# EasyEDA Pro project SRH_V1.1.eprj

# Schematic Schematic1
Create Date: 2023-09-27; Page Name: P1; Project Name: SRH_V1.1; Schematic Name: Schematic1; Update Date: 2023-09-27; Company: 嘉立创EDA; Page Size: A4; Version: V1.0
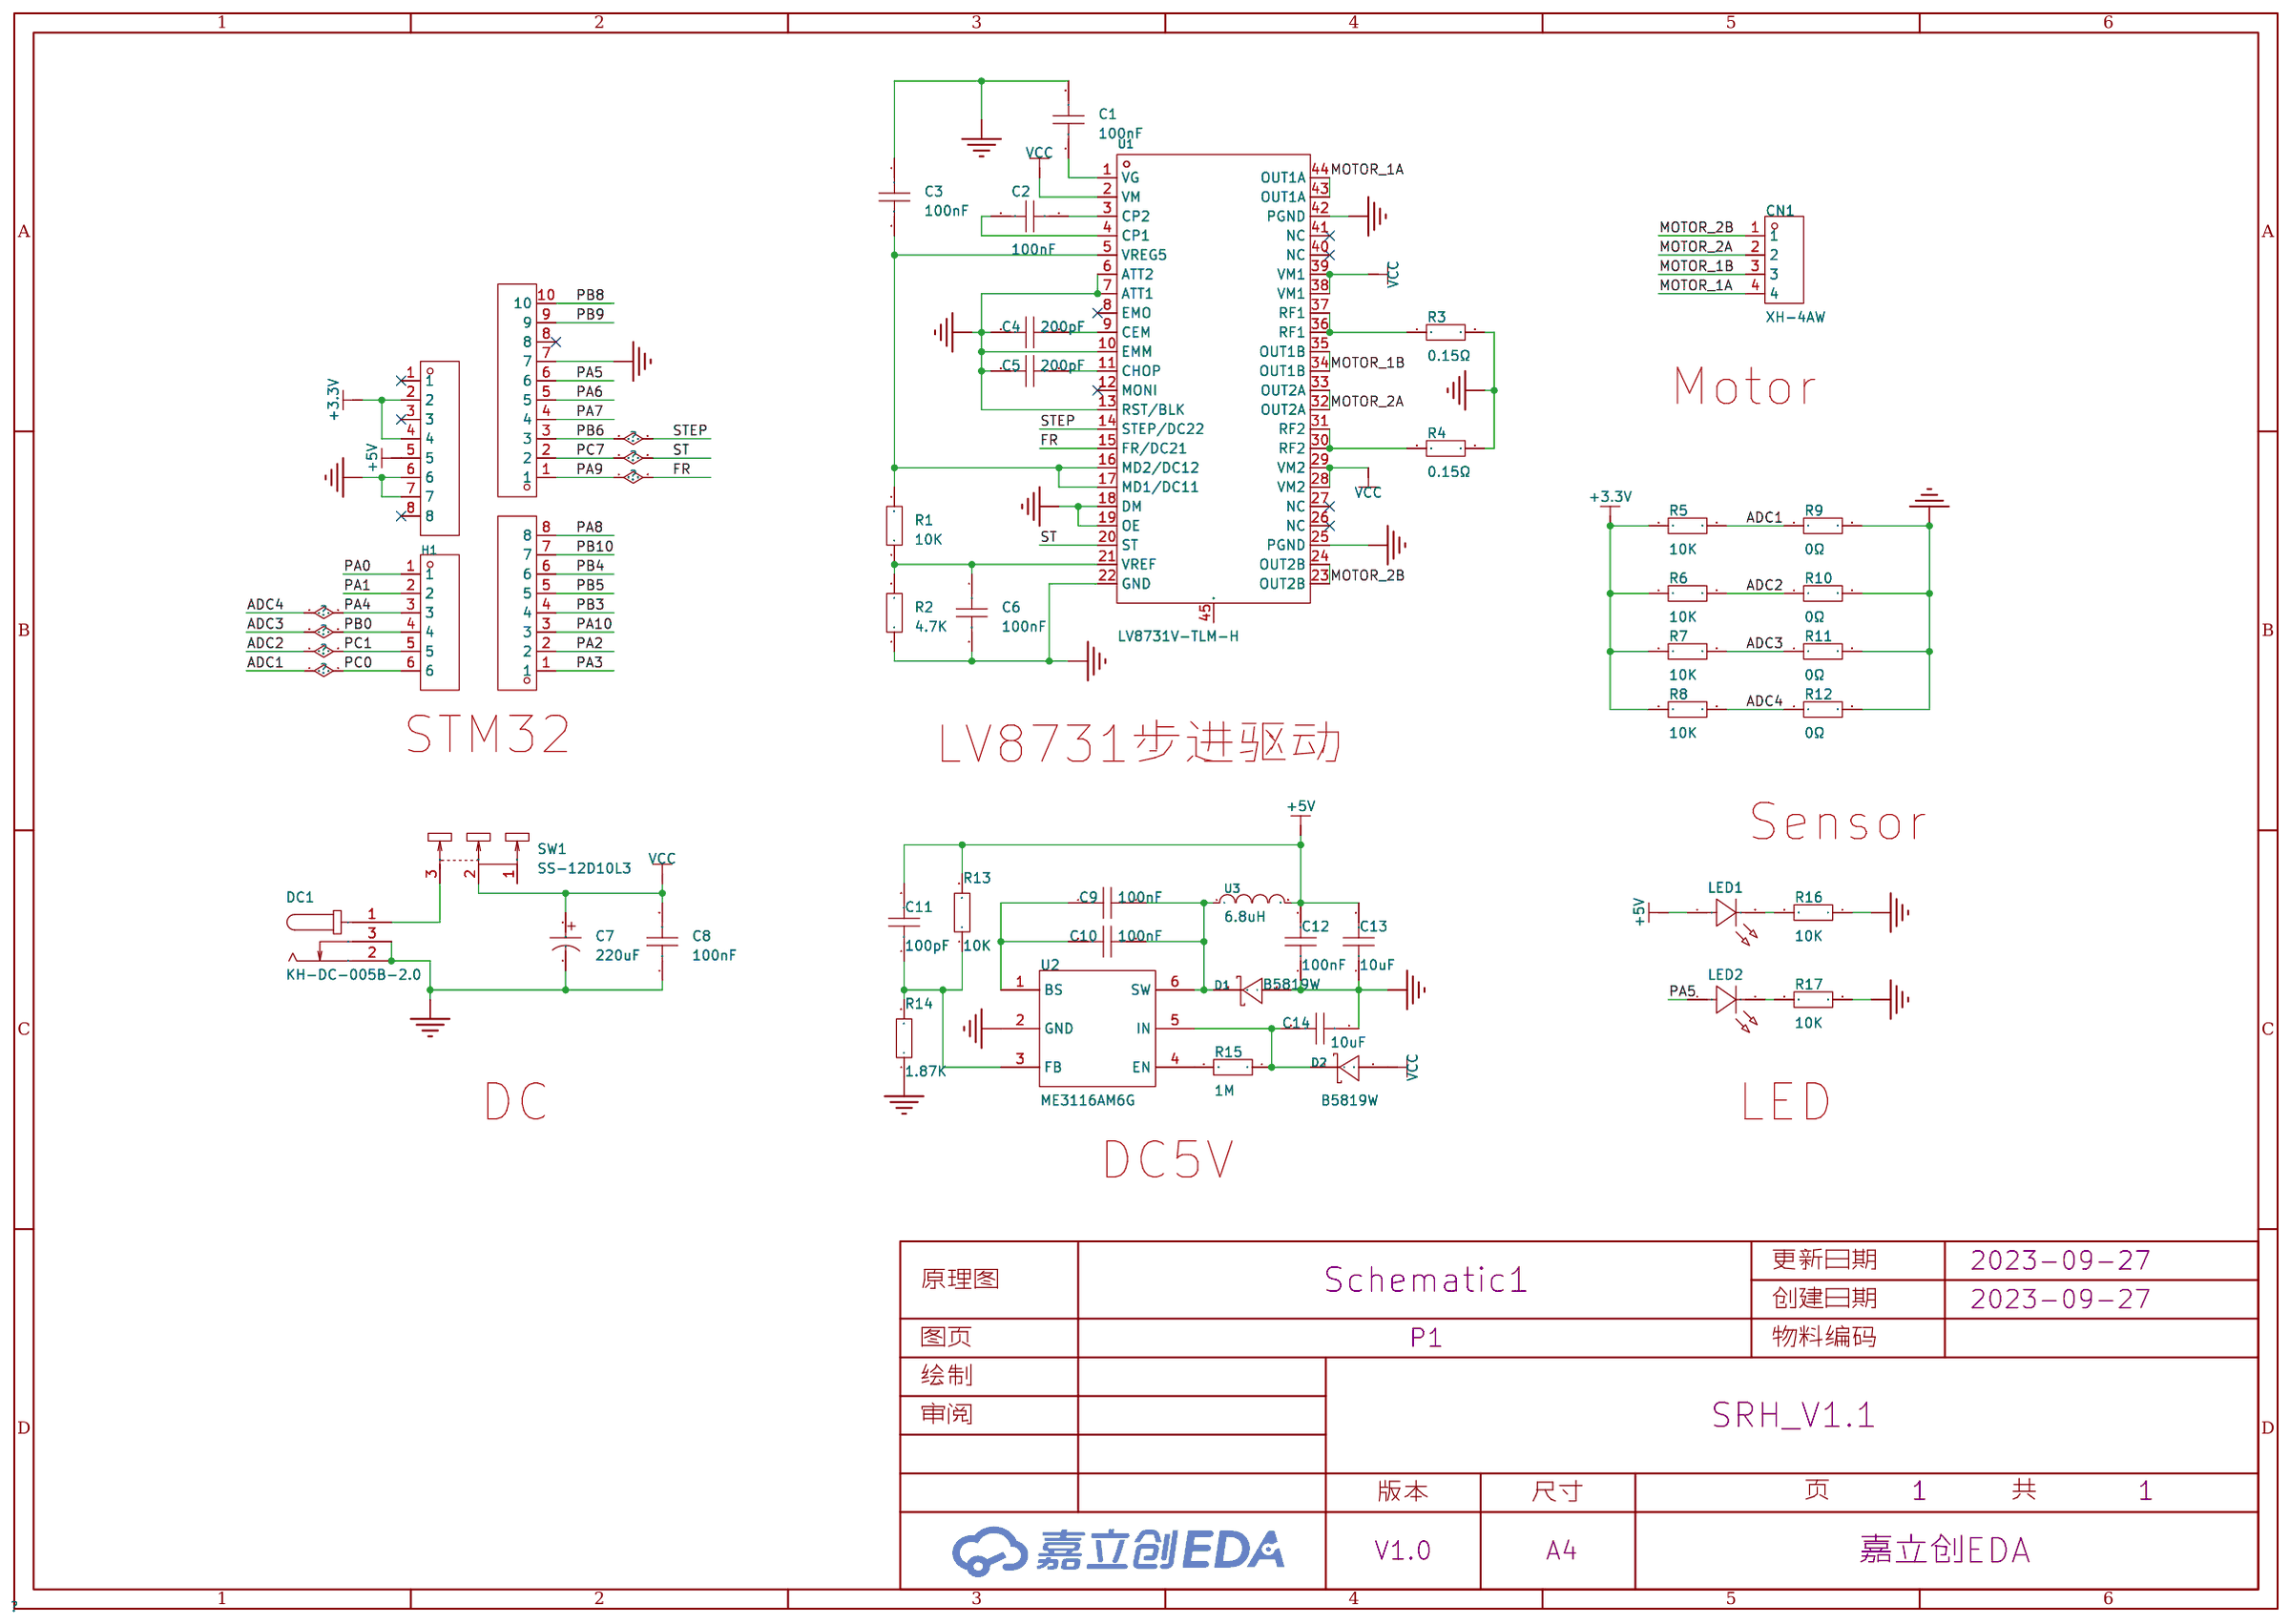
[diagram p0: schematic sheet]

## Parts
C1  100nF  [C0603]
C2  100nF  [C0603]
C3  100nF  [C0603]
C4  200pF  [C0603]
C5  200pF  [C0603]
C6  100nF  [C0603]
C7  220uF  [CAP-TH_BD8.0-P3.50-D0.6-FD]
C8  100nF  [C0603]
C9  100nF  [C0603]
C10  100nF  [C0603]
C11  100pF  [C0603]
C12  100nF  [C0603]
C13  10uF  [C0603]
C14  10uF  [C0603]
CN1  XH-4AW  [CONN-TH_XH-4AW]
D1  B5819W  [SOD-123_L2.8-W1.8-LS3.7-RD]
D2  B5819W  [SOD-123_L2.8-W1.8-LS3.7-RD]
DC1  KH-DC-005B-2.0  [DC-IN-TH_KH-DC-005B-2.0]
H1  PZ254V-11-06P  [HDR-TH_6P-P2.54-V-M]
H2  PZ254V-11-08P  [HDR-TH_8P-P2.54-V-M]
H3  PZ254V-11-08P  [HDR-TH_8P-P2.54-V-M]
H4  PZ254-1-10-Z-8.5  [HDR-TH_10P-P2.54-V-M]
LED1  19-213/GHC-ZN2Q1B8X/3T  [LED-SMD_L1.6-W0.8-RD-2]
LED2  19-213/GHC-ZN2Q1B8X/3T  [LED-SMD_L1.6-W0.8-RD-2]
R1  10K  [R0603]
R2  4.7K  [R0603]
R3  0.15Ω  [R1206]
R4  0.15Ω  [R1206]
R5  10K  [R0603]
R6  10K  [R0603]
R7  10K  [R0603]
R8  10K  [R0603]
R9  0Ω  [R1206]
R10  0Ω  [R1206]
R11  0Ω  [R1206]
R12  0Ω  [R1206]
R13  10K  [R0603]
R14  1.87K  [R0603]
R15  1M  [R0603]
R16  10K  [R0603]
R17  10K  [R0603]
SW1  SS-12D10L3  [SW-TH_SS-12D10L3]
U1  LV8731V-TLM-H  [SSOP-44_L15.5-W5.6-P0.65-LS7.6-BL-EP]
U2  ME3116AM6G  [SOT-23-6_L2.9-W1.6-P0.95-LS2.8-BL]
U3  6.8uH  [IND-SMD_L2.0-W1.6_VLS201610ET]

## Library data of the parts
C1-C6 C8 = CAP_0603: Supplier Footprint: 0603
C7 = KM227M035F12RR0VH2FP0: 容值:220uF;精度:±20%;额定电压:35V;纹波电流:-;等效串联电阻:-;; LCSC Part Name: 220uF ±20% 35V; Supplier Part: C2063; Manufacturer: CX(承兴); Supplier Footprint: 插件,D8xL12mm; JLCPCB Part Class: Extended Part; Datasheet: https://atta.szlcsc.com/upload/public/pdf/source/20211027/06D6BA3719C264B639DC286D935D03EA.pdf; Supplier: LCSC; Tolerance: ±20%; Rated Voltage: 35V; φD: 8mm; L: 12mm; Lead Spacing: 3.5mm; Lifetime @ Temp: 2000hrs@105℃
C9-C14 = CC0603KRX7R9BB104: 容值:100nF;精度:±10%;额定电压:50V;材质(温度系数):X7R;; LCSC Part Name: 100nF ±10% 50V; Supplier Part: C14663; Manufacturer: YAGEO(国巨); Supplier Footprint: 0603; JLCPCB Part Class: Basic Part; Datasheet: https://atta.szlcsc.com/upload/public/pdf/source/20180910/C282072_33301C7F631E79921B82A8DAC6BCC5B3.pdf; Supplier: LCSC; Tolerance: ±10%; Voltage Rated: 50V; Temperature Coefficient: X7R
CN1 = XH-4AW: 参考系列:XH;间距:2.54mm;插针结构:1x4P;排数:1;每排PIN数:4;行距:-;公母:公型插针;安装方式:弯插;额定电流:3A;工作温度范围:-25℃~+85℃;; LCSC Part Name: XH 2.54mm 1x4P 弯插; Supplier Part: C2908613; Manufacturer: HCTL(华灿天禄); Supplier Footprint: 插件,P=2.54mm; JLCPCB Part Class: 扩展库; Datasheet: https://atta.szlcsc.com/upload/public/pdf/source/20211021/ACA2D54D99493880102FCACAC8DAABA8.pdf; Supplier: LCSC; Reference Series: XH; Pitch: 2.54mm; Pins Structure: 1x4P; Number of Rows: 1; Number of PINs Per Row: 4; Gender: 公型插针; Mounting Style: 弯插; Current Rating (Max): 3A; Operating Temperature Range: -25℃~+85℃
D1 D2 = B5819W_C64885: 直流反向耐压(Vr):40V;平均整流电流(Io):1A;正向压降(Vf):600mV@1A;; LCSC Part Name: 电压:40V 电流:1A SL; Supplier Part: C64885; Manufacturer: MDD; Supplier Footprint: SOD-123; JLCPCB Part Class: Extended Part; Datasheet: https://atta.szlcsc.com/upload/public/pdf/source/20230823/08094EB15E96CCD3558B35DDD25E45C2.pdf; Supplier: LCSC; Reverse Voltage (Vr): 40V; Average Rectified Current (Io): 1A; Forward Voltage (Vf@If): 600mV@1A
DC1 = KH-DC-005B-2.0: 连接器类型:DC电源插座;安装方式:弯插;触点内径:2mm;触点外径:6.3mm;额定电流:500mA;额定电压:30V;工作温度范围:-30℃~+70℃;; LCSC Part Name: DC电源插座 内径:2mm 外径:6.3mm; Supplier Part: C2847171; Manufacturer: kinghelm(金航标); Supplier Footprint: 插件; JLCPCB Part Class: Extended Part; Datasheet: https://atta.szlcsc.com/upload/public/pdf/source/20230214/A6338618A3D8E8EB8F2C466F0AFC1E00.pdf; Supplier: LCSC; Connector Type: DC电源插座; Mounting Style: 弯插; Inside Contact Diameter: 2mm; Outside Contact Diameter: 6.3mm; Current Rating (Max): 500mA; Voltage Rating (Max): 30V; Operating Temperature Range: -30℃~+70℃
H1 = PZ254V-11-06P: 排数:单排;总PIN位数:6;间距:2.54mm;插针结构:1x6P;行距:-;安装类型:直插;圆针/方针:方针;额定电流:-;额定电压:-;配合针长度:6mm;塑高:2.5mm;端接针长度:3mm;触头材质:黄铜;触头镀层:-;工作温度范围:-40℃~+105℃;颜色:黑色;; LCSC Part Name: 2.54mm 1x6P 直插 方针; Supplier Part: C492405; Manufacturer: XFCN(兴飞); Supplier Footprint: 直插,P=2.54mm; JLCPCB Part Class: Extended Part; Supplier: LCSC; Number of Rows: 单排; Number of Pins: 6; Pitch: 2.54mm; Pin Structure: 1x6P; Mounting Type: 直插; Circluar Pins/Square Pins: 方针; Length of Mating Pin: 6mm; Insulation Height: 2.5mm; Length of End Connection Pin: 3mm; Contact Material: 黄铜; Operating Temperature Range: -40℃~+105℃; Color: 黑色
H2 H3 = PZ254V-11-08P: 排数:单排;总PIN位数:8P;间距:2.54mm;插针结构:1x8P;行距:-;安装类型:直插;圆针/方针:方针;额定电流:-;额定电压:-;配合针长度:6mm;塑高:2.5mm;端接针长度:3mm;触头材质:黄铜;触头镀层:-;工作温度范围:-40℃~+105℃;颜色:黑色;; LCSC Part Name: 2.54mm 1x8P 直插 方针; Supplier Part: C492407; Manufacturer: XFCN(兴飞); Supplier Footprint: 插件,P=2.54mm; JLCPCB Part Class: 扩展库; Datasheet: https://atta.szlcsc.com/upload/public/pdf/source/20200309/C492407_83A6FB26A2233368EDB9516968EC6149.pdf; Supplier: LCSC; Number of Rows: 单排; Number of Pins: 8P; Pitch: 2.54mm; Pin Structure: 1x8P; Mounting Type: 直插; Circluar Pins/Square Pins: 方针; Length of Mating Pin: 6mm; Insulation Height: 2.5mm; Length of End Connection Pin: 3mm; Contact Material: 黄铜; Operating Temperature Range: -40℃~+105℃; Color: 黑色
H4 = PZ254-1-10-Z-8.5: 排数:单排;总PIN位数:10P;间距:2.54mm;插针结构:1x10P;行距:-;安装类型:直插;圆针/方针:方针;额定电流:3A;额定电压:-;配合针长度:6mm;塑高:2.5mm;端接针长度:3mm;触头材质:-;工作温度范围:-40℃~+105℃;颜色:黑色;; LCSC Part Name: 2.54mm 1x10P 直插 方针; Supplier Part: C2894933; Manufacturer: HCTL(华灿天禄); Supplier Footprint: 插件,P=2.54mm; JLCPCB Part Class: 扩展库; Datasheet: https://atta.szlcsc.com/upload/public/pdf/source/20230609/805D25CEF03592837AF6F506EEB5ED41.pdf; Supplier: LCSC; Number of Rows: 单排; Number of Pins: 10P; Pitch: 2.54mm; Pin Structure: 1x10P; Mounting Type: 直插; Circluar Pins/Square Pins: 方针; Current Rating (Max): 3A; Length of Mating Pin: 6mm; Insulation Height: 2.5mm; Length of End Connection Pin: 3mm; Operating Temperature Range: -40℃~+105℃; Color: 黑色
LED1 LED2 = 19-213/GHC-ZN2Q1B8X/3T: LCSC Part Name: LED; Supplier Part: C4749155; Manufacturer: EVERLIGHT(亿光); Supplier Footprint: SMD,0.8x1.6mm; JLCPCB Part Class: Extended Part; Datasheet: https://atta.szlcsc.com/upload/public/pdf/source/20220713/A02AED81541ACC0AB94B59F8C2FBBAFC.pdf; Supplier: LCSC
R1 R2 R5-R8 R13-R17 = Res_0603: Supplier Footprint: 0603
R3 R4 R9-R12 = 1206W4F0000T5E: 电阻类型:厚膜电阻;阻值:0Ω;精度:±1%;功率:250mW;温度系数:±800ppm/℃;最大工作电压:200V;工作温度范围:-55℃~+155℃;; LCSC Part Name: 0Ω ±1% 250mW; Supplier Part: C17888; Manufacturer: UNI-ROYAL(厚声); Supplier Footprint: 1206; JLCPCB Part Class: Basic Part; Supplier: LCSC; Type: 厚膜电阻; Tolerance: ±1%; Power(Watts): 250mW; Temperature Coefficient: ±800ppm/℃; Overload Voltage (Max): 200V; Operating Temperature Range: -55℃~+155℃
SW1 = SS-12D10L3: 额定电流(DC):3A;额定电压(DC):125V;额定电流(AC):3A;额定电压(AC):125V;电路结构:单刀双掷;安装方式:直插;机械寿命:1万次;开关颜色:黑色;; LCSC Part Name: 柄长3mm 直插双档 滑动开关 大电流; Supplier Part: C319013; Manufacturer: XKB Connectivity(中国星坤); Supplier Footprint: 插件; JLCPCB Part Class: Extended Part; Datasheet: https://atta.szlcsc.com/upload/public/pdf/source/20211009/D6412F37AABE6F9459A6EE7FA4DAEADB.pdf; Supplier: LCSC; Current Rating (DC): 3A; Voltage Rating (DC): 125V; Current Rating (AC): 3A; Voltage Rating (AC): 125V; Circuit: 单刀双掷; Mounting Style: 直插; Mechanical Life: 1万次; Actuator Color: 黑色; Actuator Style: 矩形柱状; Pin Style: PC引脚; Operating Temperature: -40℃~+85℃; Switch Length: 13mm; Switch Width: 6.8mm; Switch Height: 6.4mm
U1 = LV8731V-TLM-H: PWM恒流控制步进电机驱动器; Supplier Part: C40157; Manufacturer: onsemi(安森美); Supplier Footprint: SSOP-44-EP-275mil; JLCPCB Part Class: 扩展库; Datasheet: https://atta.szlcsc.com/upload/public/pdf/source/20141219/1457707256773.pdf; Supplier: LCSC
U2 = ME3116AM6G_C97643: 功能类型:降压型;同步整流:-;输出通道数:-;拓扑结构:-;输入电压:-;输出电流(最大值):-;开关频率:-;; LCSC Part Name: 降压型; Supplier Part: C97643; Manufacturer: MICRONE(南京微盟); Supplier Footprint: SOT-23-6; JLCPCB Part Class: 扩展库; Datasheet: https://atta.szlcsc.com/upload/public/pdf/source/20170322/1490151692992.pdf; Supplier: LCSC; Function: 降压型
U3 = VLS201612CX-6R8M-1: 电感值:6.8uH;精度:±20%;额定电流:820mA;饱和电流(Isat):1.09A;; LCSC Part Name: 6.8uH ±20% 1.09A; Supplier Part: C2044628; Manufacturer: TDK; Supplier Footprint: 0806; JLCPCB Part Class: 扩展库; Datasheet: https://atta.szlcsc.com/upload/public/pdf/source/20210427/CFC1D725C251B786D93D251B19809CB8.pdf; Supplier: LCSC; Tolerance: ±20%; Rated Current: 820mA; Saturation Current (Isat): 1.09A; DC Resistance (DCR): 307mΩ

## Nets
+3.3V: H3.2 H3.4 R5.1 R6.1 R7.1 R8.1
+5V: C11.2 C12.2 C13.2 H3.5 LED1.1(A) R13.2 U3.2
GND: C1.2 C3.1 C4.2 C5.2 C6.2 C7.2 C8.1 C12.1 C13.1 C14.1 D1.2(A) DC1.2 DC1.3 H3.6 H3.7 H4.7 R2.1 R3.2 R4.2 R9.2 R10.2 R11.2 R12.2 R14.1 R16.1 R17.1 U1.6(ATT2) U1.7(ATT1) U1.10(EMM) U1.13(RST/BLK) U1.18(DM) U1.19(OE) U1.22(GND) U1.25(PGND) U1.42(PGND) U2.2(GND)
VCC: C7.1 C8.2 D2.2(A) SW1.2 U1.2(VM) U1.28(VM2) U1.29(VM2) U1.38(VM1) U1.39(VM1)
ADC1: H1.6 R5.2 R9.1
ADC2: H1.5 R6.2 R10.1
ADC3: H1.4 R7.2 R11.1
ADC4: H1.3 R8.2 R12.1
FR: H4.1 U1.15(FR/DC21)
MOTOR_1A: CN1.4 U1.43(OUT1A) U1.44(OUT1A)
MOTOR_1B: CN1.3 U1.34(OUT1B) U1.35(OUT1B)
MOTOR_2A: CN1.2 U1.32(OUT2A) U1.33(OUT2A)
MOTOR_2B: CN1.1 U1.23(OUT2B) U1.24(OUT2B)
PA0: H1.1
PA1: H1.2
PA2: H2.2
PA3: H2.1
PA5: H4.6 LED2.1(A)
PA6: H4.5
PA7: H4.4
PA8: H2.8
PA10: H2.3
PB3: H2.4
PB4: H2.6
PB5: H2.5
PB6: H4.3 U1.14(STEP/DC22)
PB8: H4.10
PB9: H4.9
PB10: H2.7
PC7: H4.2 U1.20(ST)
$1N1956: C1.1 U1.1(VG)
$1N1959: C2.1 U1.3(CP2)
$1N1960: C2.2 U1.4(CP1)
$1N1962: C4.1 U1.9(CEM)
$1N1963: C5.1 U1.11(CHOP)
$1N1976: C3.2 R1.2 U1.5(VREG5) U1.16(MD2/DC12) U1.17(MD1/DC11)
$1N1996: R3.1 U1.36(RF1) U1.37(RF1)
$1N1997: R4.1 U1.30(RF2) U1.31(RF2)
$1N2000: C6.1 R1.1 R2.2 U1.21(VREF)
$1N2982: DC1.1 SW1.3
$1N3728: C11.1 R13.1 R14.2 U2.3(FB)
$1N3749: C9.1 C10.1 U2.1(BS)
$1N3774: C9.2 C10.2 D1.1(K) U2.6(SW) U3.1
$1N3841: C14.2 D2.1(K) R15.1 U2.5(IN)
$1N3853: R15.2 U2.4(EN)
$1N4639: LED1.2(K) R16.2
$1N4783: LED2.2(K) R17.2

Not connected (* = marked no-connect by the designer): H3 1* 3* 8*; H4 8*; SW1 1; U1 8(EMO)* 12(MONI)* 26(NC)* 27(NC)* 40(NC)* 41(NC)* 45

## Notes on the sheet
- Motor
- STM32
- LV8731步进驱动
- Sensor
- DC
- LED
- DC5V

# Board PCB1
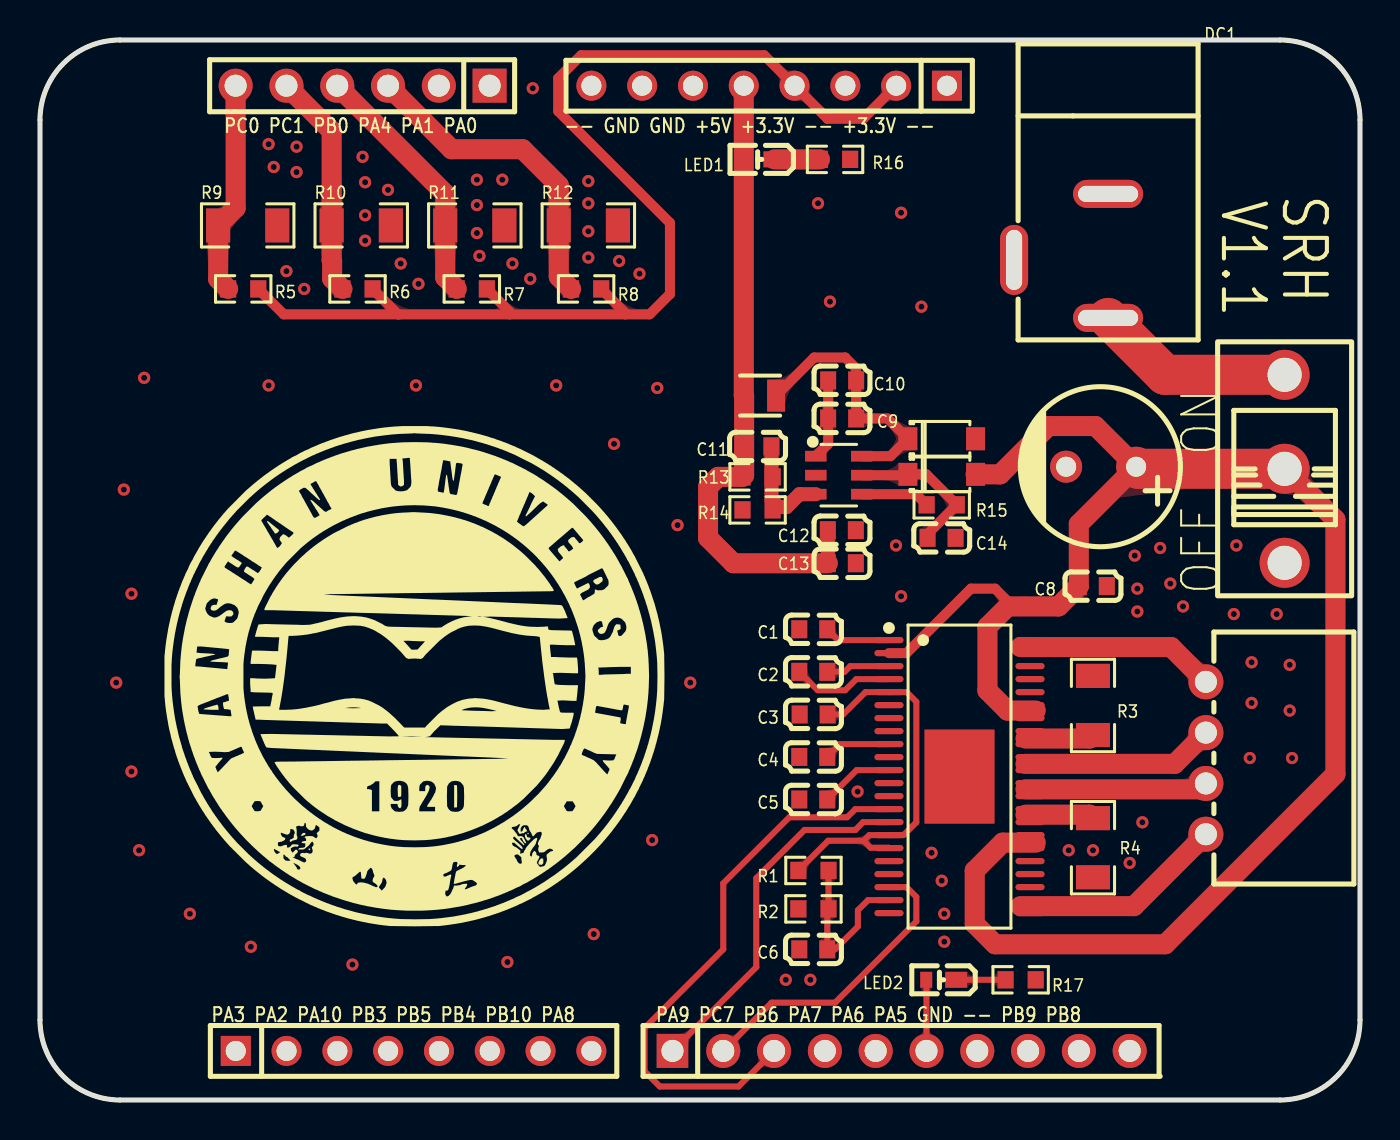
[diagram p1: board, top side]
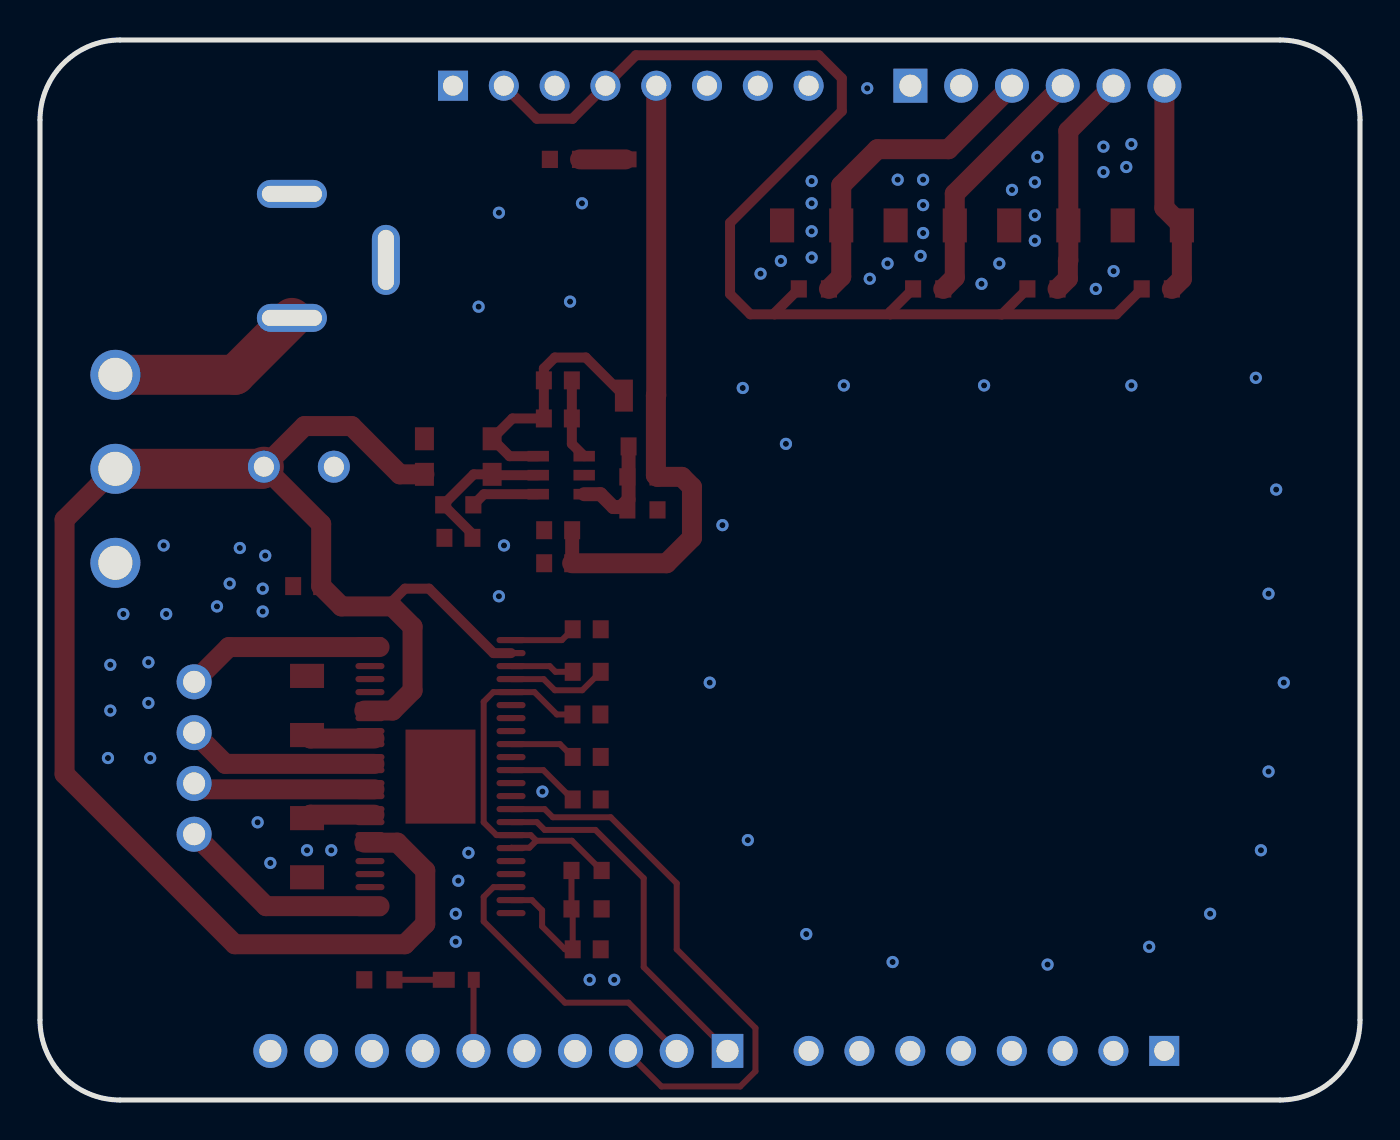
[diagram p2: board, bottom side, seen from below]

Outline 66 x 53 mm; copper layers: Top Layer, Bottom Layer. Coordinates in mm from the lower left corner of the outline.
Outline path: 0,49 0,4 arc(1.17,1.17) 4,0 62,0 arc(64.83,1.17) 66,4 66,49 arc(64.83,51.83) 62,53 4,53 arc(1.17,51.83) 0,49
Stack: Top Layer 0.035mm / Dielectric1 1.51mm FR4 er 4.5 / Bottom Layer 0.035mm

## Design rules (mm)
template: 自定义配置
spacing copperThickness1oz (default): track to track 0.102, other pairs 0.152 to 0.3
spacing copperThickness2oz: track to track 0.203, other pairs 0.152 to 0.3
track width copperThickness1oz (default): min 0.127, default 0.254, max 2.54
track width copperThickness2oz: min 0.203, default 0.254, max 2.54
differential pair differentialPair (default): width min 0.127, default 0.254, max 2.54; gap min 0.152, default 0.152
via viaSize (default): diameter min 0.5, default 0.61, max 10; hole min 0.3, default 0.305, max 6.3

## Placement (name value [footprint] x y rotation side)
C1  100nF  [C0603]  38.66 23.54 180 top
C2  100nF  [C0603]  38.66 21.41 180 top
C3  100nF  [C0603]  38.68 19.28 0 top
C4  200pF  [C0603]  38.66 17.15 180 top
C5  200pF  [C0603]  38.66 15.03 180 top
C6  100nF  [C0603]  38.66 7.53 180 top
C7  220uF  [CAP-TH_BD8.0-P3.50-D0.6-FD]  53.06 31.66 180 top
C8  100nF  [C0603]  52.64 25.69 180 top
C9  100nF  [C0603]  40.11 34.08 0 top
C10  100nF  [C0603]  40.11 35.98 0 top
C11  100pF  [C0603]  35.87 32.68 180 top
C12  100nF  [C0603]  40.09 28.49 180 top
C13  10uF  [C0603]  40.09 26.84 180 top
C14  10uF  [C0603]  45.08 28.11 180 top
CN1  XH-4AW  [CONN-TH_XH-4AW]  58.29 17.1 90 top
D1  B5819W  [SOD-123_L2.8-W1.8-LS3.7-RD]  45.09 33.06 0 top
D2  B5819W  [SOD-123_L2.8-W1.8-LS3.7-RD]  45.09 31.28 0 top
DC1  KH-DC-005B-2.0  [DC-IN-TH_KH-DC-005B-2.0]  51.06 42.2 270 top
H1  PZ254V-11-06P  [HDR-TH_6P-P2.54-V-M]  16.13 50.71 180 top
H2  PZ254V-11-08P  [HDR-TH_8P-P2.54-V-M]  18.68 2.45 0 top
H3  PZ254V-11-08P  [HDR-TH_8P-P2.54-V-M]  36.46 50.71 180 top
H4  PZ254-1-10-Z-8.5  [HDR-TH_10P-P2.54-V-M]  43.05 2.45 0 top
LED1  19-213/GHC-ZN2Q1B8X/3T  [LED-SMD_L1.6-W0.8-RD-2]  35.97 47.03 180 top
LED2  19-213/GHC-ZN2Q1B8X/3T  [LED-SMD_L1.6-W0.8-RD-2]  45.06 6.01 180 top
R1  10K  [R0603]  38.67 11.48 180 top
R2  4.7K  [R0603]  38.67 9.56 0 top
R3  0.15Ω  [R1206]  52.65 19.73 90 top
R4  0.15Ω  [R1206]  52.65 12.61 270 top
R5  10K  [R0603]  10.16 40.55 180 top
R6  10K  [R0603]  15.88 40.55 180 top
R7  10K  [R0603]  21.59 40.55 180 top
R8  10K  [R0603]  27.31 40.55 180 top
R9  0Ω  [R1206]  10.38 43.73 0 top
R10  0Ω  [R1206]  16.06 43.73 0 top
R11  0Ω  [R1206]  21.74 43.73 0 top
R12  0Ω  [R1206]  27.42 43.73 0 top
R13  10K  [R0603]  35.88 31.16 180 top
R14  1.87K  [R0603]  35.88 29.5 0 top
R15  1M  [R0603]  45.09 29.76 180 top
R16  10K  [R0603]  39.75 47.03 180 top
R17  10K  [R0603]  49.03 6.01 180 top
SW1  SS-12D10L3  [SW-TH_SS-12D10L3]  62.23 31.56 90 top
U1  LV8731V-TLM-H  [SSOP-44_L15.5-W5.6-P0.65-LS7.6-BL-EP]  45.97 16.17 270 top
U2  ME3116AM6G  [SOT-23-6_L2.9-W1.6-P0.95-LS2.8-BL]  39.94 31.24 270 top
U3  6.8uH  [IND-SMD_L2.0-W1.6_VLS201610ET]  36.01 35.22 180 top

## Footprints (pads in the part's own frame, mm; a bottom-side part is the same pattern mirrored in y, then rotated)
C0603
  rect 0.8x0.9 smd: 1(-0.7,0) 2(0.7,0)
CAP-TH_BD8.0-P3.50-D0.6-FD
  round 1.6 hole 1: 1(-1.75,0) 2(1.75,0)
CONN-TH_XH-4AW
  round 1.75 hole 1.1: 1(-3.81,0) 2(-1.27,0) 3(1.27,0) 4(3.81,0)
DC-IN-TH_KH-DC-005B-2.0
  oval 1.4x3.5 hole 0.8x3: 1(3.1,2.35) 2(-3.1,2.35)
  oval 3.5x1.4 hole 3x0.8: 3(0.2,-2.35)
HDR-TH_6P-P2.54-V-M
  rect 1.7x1.7 hole 1.1: 1(-6.35,0)
  round 1.7 hole 1.1: 2(-3.81,0) 3(-1.27,0) 4(1.27,0) 5(3.81,0) 6(6.35,0)
HDR-TH_8P-P2.54-V-M
  rect 1.5x1.5 hole 1: 1(-8.89,0)
  round 1.5 hole 1: 2(-6.35,0) 3(-3.81,0) 4(-1.27,0) 5(1.27,0) 6(3.81,0) 7(6.35,0) 8(8.89,0)
HDR-TH_10P-P2.54-V-M
  rect 1.575x1.7 hole 1.1: 1(-11.43,0)
  round 1.7 hole 1.1: 2(-8.89,0) 3(-6.35,0) 4(-3.81,0) 5(-1.27,0) 6(1.27,0) 7(3.81,0) 8(6.35,0) 9(8.89,0) 10(11.43,0)
IND-SMD_L2.0-W1.6_VLS201610ET
  rect 0.9x1.6 smd: 1(-0.8,0) 2(0.8,0)
LED-SMD_L1.6-W0.8-RD-2
  rect 0.6x0.8 smd: 1(0.75,0)
  rect 1.1x0.8 smd: 2(-0.75,0)
R0603
  rect 0.806x0.864 smd: 1(-0.753,0) 2(0.753,0)
R1206
  rect 1.208x1.701 smd: 1(-1.479,0) 2(1.479,0)
SOD-123_L2.8-W1.8-LS3.7-RD
  rect 0.95x1.15 smd: 1(-1.692,0) 2(1.692,0)
SOT-23-6_L2.9-W1.6-P0.95-LS2.8-BL
  rect 0.532x1.072 smd: 1(-0.95,-1.149) 2(0,-1.149) 3(0.95,-1.149) 4(0.95,1.149) 5(0,1.149) 6(-0.95,1.149)
SSOP-44_L15.5-W5.6-P0.65-LS7.6-BL-EP
  oval 0.308x1.454 smd: 1(-6.825,-3.527) 2(-6.175,-3.527) 3(-5.525,-3.527) 4(-4.875,-3.527) 5(-4.225,-3.527) 6(-3.575,-3.527) 7(-2.925,-3.527) 8(-2.275,-3.527) 9(-1.625,-3.527) 10(-0.975,-3.527) 11(-0.325,-3.527) 12(0.325,-3.527) 13(0.975,-3.527) 14(1.625,-3.527) 15(2.275,-3.527) 16(2.925,-3.527) 17(3.575,-3.527) 18(4.225,-3.527) 19(4.875,-3.527) 20(5.525,-3.527) 21(6.175,-3.527) 22(6.825,-3.527) 23(6.825,3.527) 24(6.175,3.527) 25(5.525,3.527) 26(4.875,3.527) 27(4.225,3.527) 28(3.575,3.527) 29(2.925,3.527) 30(2.275,3.527) 31(1.625,3.527) 32(0.975,3.527) 33(0.325,3.527) 34(-0.325,3.527) 35(-0.975,3.527) 36(-1.625,3.527) 37(-2.275,3.527) 38(-2.925,3.527) 39(-3.575,3.527) 40(-4.225,3.527) 41(-4.875,3.527) 42(-5.525,3.527) 43(-6.175,3.527) 44(-6.825,3.527)
  rect 4.7x3.5 smd: 45(0,0)
SW-TH_SS-12D10L3
  round 2.5 hole 1.7: 1(-4.7,0) 2(0,0) 3(4.7,0)

## Nets
As in the schematic.

Pads without a net: H3 1 3 8; H4 8; SW1 1; U1 8 12 26 27 40 41 45

## Via types
v1: diameter 0.61, hole 0.305, Top Layer to Bottom Layer, 78 vias

## Routing (per net, layer and track width the routed paths; a pad name or vN(x,y) marks a point on that pad's centre or on a via; arc(x,y) is an arc through that point)
+3.3V: length 59.4
  Top Layer w0.5: 23.49,39.28 29.27,39.28 ; 23.49,39.28 23.49,39.41 R7.1 ; 23.49,39.28 17.9,39.28 ; 29.27,39.28 30.48,39.28 31.5,40.3 31.5,43.86 25.91,49.44 25.91,51.09 27.06,52.24 36.2,52.24 H3.4 39.37,49.07 39.37,49.06 41.16,49.06 H3.2 ; 29.27,39.28 29.27,39.34 R8.1 ; R6.1 17.9,39.28 ; 17.9,39.28 12.18,39.28 R5.1 ; 17.9,39.28 18.01,39.28
+5V: length 32.2
  Top Layer w0.7: C13.2 C12.2
  Top Layer w1: C13.2 34.67,26.84 33.4,28.11 33.4,30.65 33.91,31.16 R13.2 35.21,31.24 U3.2 35.19,35.24 H3.5
GND:
  vias: v1(3.81,20.87) v1(4.19,30.52) v1(4.57,25.31) v1(4.57,16.42) v1(4.95,12.49) v1(5.21,36.11) v1(7.49,9.31) v1(10.54,7.66) v1(11.43,47.79) v1(11.43,35.73) v1(11.69,46.65) v1(12.32,41.44) v1(12.83,47.67) v1(12.83,46.4) v1(13.21,40.55) v1(15.62,6.77) v1(16.13,47.16) v1(16.26,45.89) v1(16.26,44.24) v1(16.26,42.97) v1(17.4,45.51) v1(18.03,41.82) v1(18.8,35.73) v1(18.92,40.81) v1(21.84,46.02) v1(21.84,44.75) v1(21.84,43.35) v1(21.97,42.2) v1(23.12,46.02) v1(23.37,6.9) v1(23.62,41.82) v1(24.51,41.06) v1(24.64,50.59) v1(25.81,35.73) v1(27.42,45.94) v1(27.42,44.84) v1(27.42,43.44) v1(27.42,42.12) v1(27.69,8.3) v1(28.7,32.81) v1(28.96,41.95) v1(29.97,41.32) v1(30.61,13) v1(30.86,35.6) v1(31.88,28.74) v1(32.51,20.87) v1(37.29,6.01) v1(38.52,6.01) v1(38.9,44.84) v1(39.5,39.92) v1(40.88,15.42) v1(42.8,27.73) v1(43.05,44.36) v1(43.05,25.19) v1(44.07,39.67) v1(44.58,12.36) v1(45.09,10.96) v1(45.21,9.31) v1(45.21,7.92) v1(51.44,12.49) v1(52.65,12.49) v1(54.48,11.85) v1(54.74,27.22) v1(54.87,25.57) v1(54.87,24.42) v1(55.12,13.88) v1(56.01,27.6) v1(56.52,25.82) v1(57.15,24.68) v1(59.69,24.3) v1(59.82,27.73) v1(60.49,17.1) v1(60.58,21.89) v1(60.58,19.85) v1(61.83,24.3) v1(62.49,21.76) v1(62.49,19.47) v1(62.6,17.1)
VCC: length 88.3
  Top Layer w0.5: 48.39,24.68 48.39,24.93 47.75,25.57 46.55,25.57 43.32,22.34 U1.2
  Top Layer w1: D2.2 48.01,31.28 50.42,33.7 52.77,33.7 C7.1 51.94,28.8 51.94,25.69 50.93,24.68 48.39,24.68 47.37,23.66 47.37,20.47 48.37,19.47 49.78,19.47 ; SW1.2 64.77,29.02 64.77,16.3 56.26,7.79 47.75,7.79 46.74,8.8 46.74,11.47 48.13,12.87 49.78,12.87
  Top Layer w2: C7.1 54.91,31.56 SW1.2
ADC1: length 10.7
  Top Layer w1: R5.2 8.91,41.06 R9.1 9.78,44.6 H1.6
ADC2: length 11.3
  Top Layer w1: R6.2 14.61,41.07 14.61,41.95 14.58,41.97 R10.1 14.58,48.45 H1.5
ADC3: length 12.6
  Top Layer w1: H1.4 20.26,45.31 R11.1 20.26,41.13 R7.2
ADC4: length 16
  Top Layer w1: R8.2 25.94,41.17 R12.1 25.94,45.73 24.13,47.54 20.58,47.54 H1.3
FR: length 18.2
  Top Layer w0.3: U1.15 41.16,13.89 40.77,13.5 38.23,13.5 35.81,11.09 35.81,6.64 H4.1
MOTOR_1A: length 10
  Top Layer w1: 49.02,22.65 56.56,22.65 CN1.4
MOTOR_1B: length 9.7
  Top Layer w1: 49.28,16.81 56.73,16.81 CN1.3
MOTOR_2A: length 9.1
  Top Layer w1: CN1.2 58,15.53 49.28,15.53
MOTOR_2B: length 10.8
  Top Layer w1: 49.02,9.69 54.7,9.69 CN1.1
PA5: length 3.6
  Top Layer w0.3: LED2.1 44.32,6 H4.6
PB6: length 28.4
  Top Layer w0.3: U1.14 40.77,14.55 40.36,14.14 37.47,14.14 34.16,10.84 34.16,7.53 30.23,3.6 30.23,1.44 30.99,0.68 34.93,0.68 H4.3
PC7: length 15.1
  Top Layer w0.3: H4.2 36.58,4.87 39.75,4.87 43.82,8.93 43.82,10.15 43.32,10.64 U1.20
$1N1956: length 3.3
  Top Layer w0.3: C1.1 39.91,23 U1.1
$1N1959: length 3.2
  Top Layer w0.3: U1.3 40.51,21.69 40.23,21.41 C2.1
$1N1960: length 5.1
  Top Layer w0.3: U1.4 40.82,21.05 40.26,20.49 38.89,20.49 C2.2
$1N1962: length 3.3
  Top Layer w0.3: U1.9 40,17.8 C4.1
$1N1963: length 3.7
  Top Layer w0.3: U1.11 40.83,16.5 C5.1
$1N1976: length 19.4
  Top Layer w0.3: C3.2 40.16,19.28 41.28,20.39 U1.5 43.33,20.39 43.82,19.91 43.82,13.88 43.18,13.25 U1.16 41.47,13.25 41.18,12.96 ; R1.2 39.4,12.96 41.18,12.96 ; U1.17 42.43,12.61 41.53,12.61 41.18,12.96
$1N1996: length 3.4
  Top Layer w1: 49.28,18.08 52.48,18.08 R3.1
$1N1997: length 3.4
  Top Layer w1: 49.28,14.27 52.48,14.27 R4.1
$1N2000: length 8.5
  Top Layer w0.3: R1.1 R2.2 39.37,9.49 C6.1 39.75,7.53 40.9,8.68 40.9,9.49 41.4,10 U1.21
$1N2982: length 10
  Top Layer w2: SW1.3 56.25,36.26 DC1.1
$1N3728: length 5.3
  Top Layer w0.7: U2.3 37.97,30.29 37.33,29.65 36.94,29.65 36.57,30.02 36.57,32.68
$1N3749: length 4
  Top Layer w0.5: C10.1 C9.1 39.41,32.81 U2.1
$1N3774: length 13.2
  Top Layer w0.5: U3.1 38.71,37.12 40.26,37.12 40.81,36.58 C10.2 C9.2 42.38,34.08 D1.1 42.52,32.19 U2.6
$1N3841: length 7.7
  Top Layer w0.5: C14.2 44.38,28.3 R15.1 44.32,31.28 D2.1 43.35,31.24 U2.5
$1N3853: length 3.5
  Top Layer w0.5: R15.2 43.8,30.29 U2.4
$1N4639: length 2.3
  Top Layer w1: LED1.2 R16.2
$1N4783: length 2.5
  Top Layer w0.3: LED2.2 R17.2

## Copper pours and planes (outline as drawn; the poured copper is in the pictures)
GND on Top Layer: -0.51,53.64 66.68,53.64 66.68,-0.59 -0.51,-0.59
GND on Bottom Layer: -0.51,53.64 66.68,53.64 66.68,-0.59 -0.51,-0.59

Small or netless copper shapes (teardrops, artwork), in the pictures only: 95 on Top Layer

## Text on the board
Top Silkscreen Layer: PA3 PA2 PA10 PB3 PB5 PB4 PB10 PA8 | PC0 PC1 PB0 PA4 PA1 PA0 | -- GND GND +5V +3.3V -- +3.3V -- | PA9 PC7 PB6 PA7 PA6 PA5 GND -- PB9 PB8 | OFF  ON | V1.1 | SRH
